# EAGLE design esp8266-dev-ftdi (EAGLE 7.1.0)
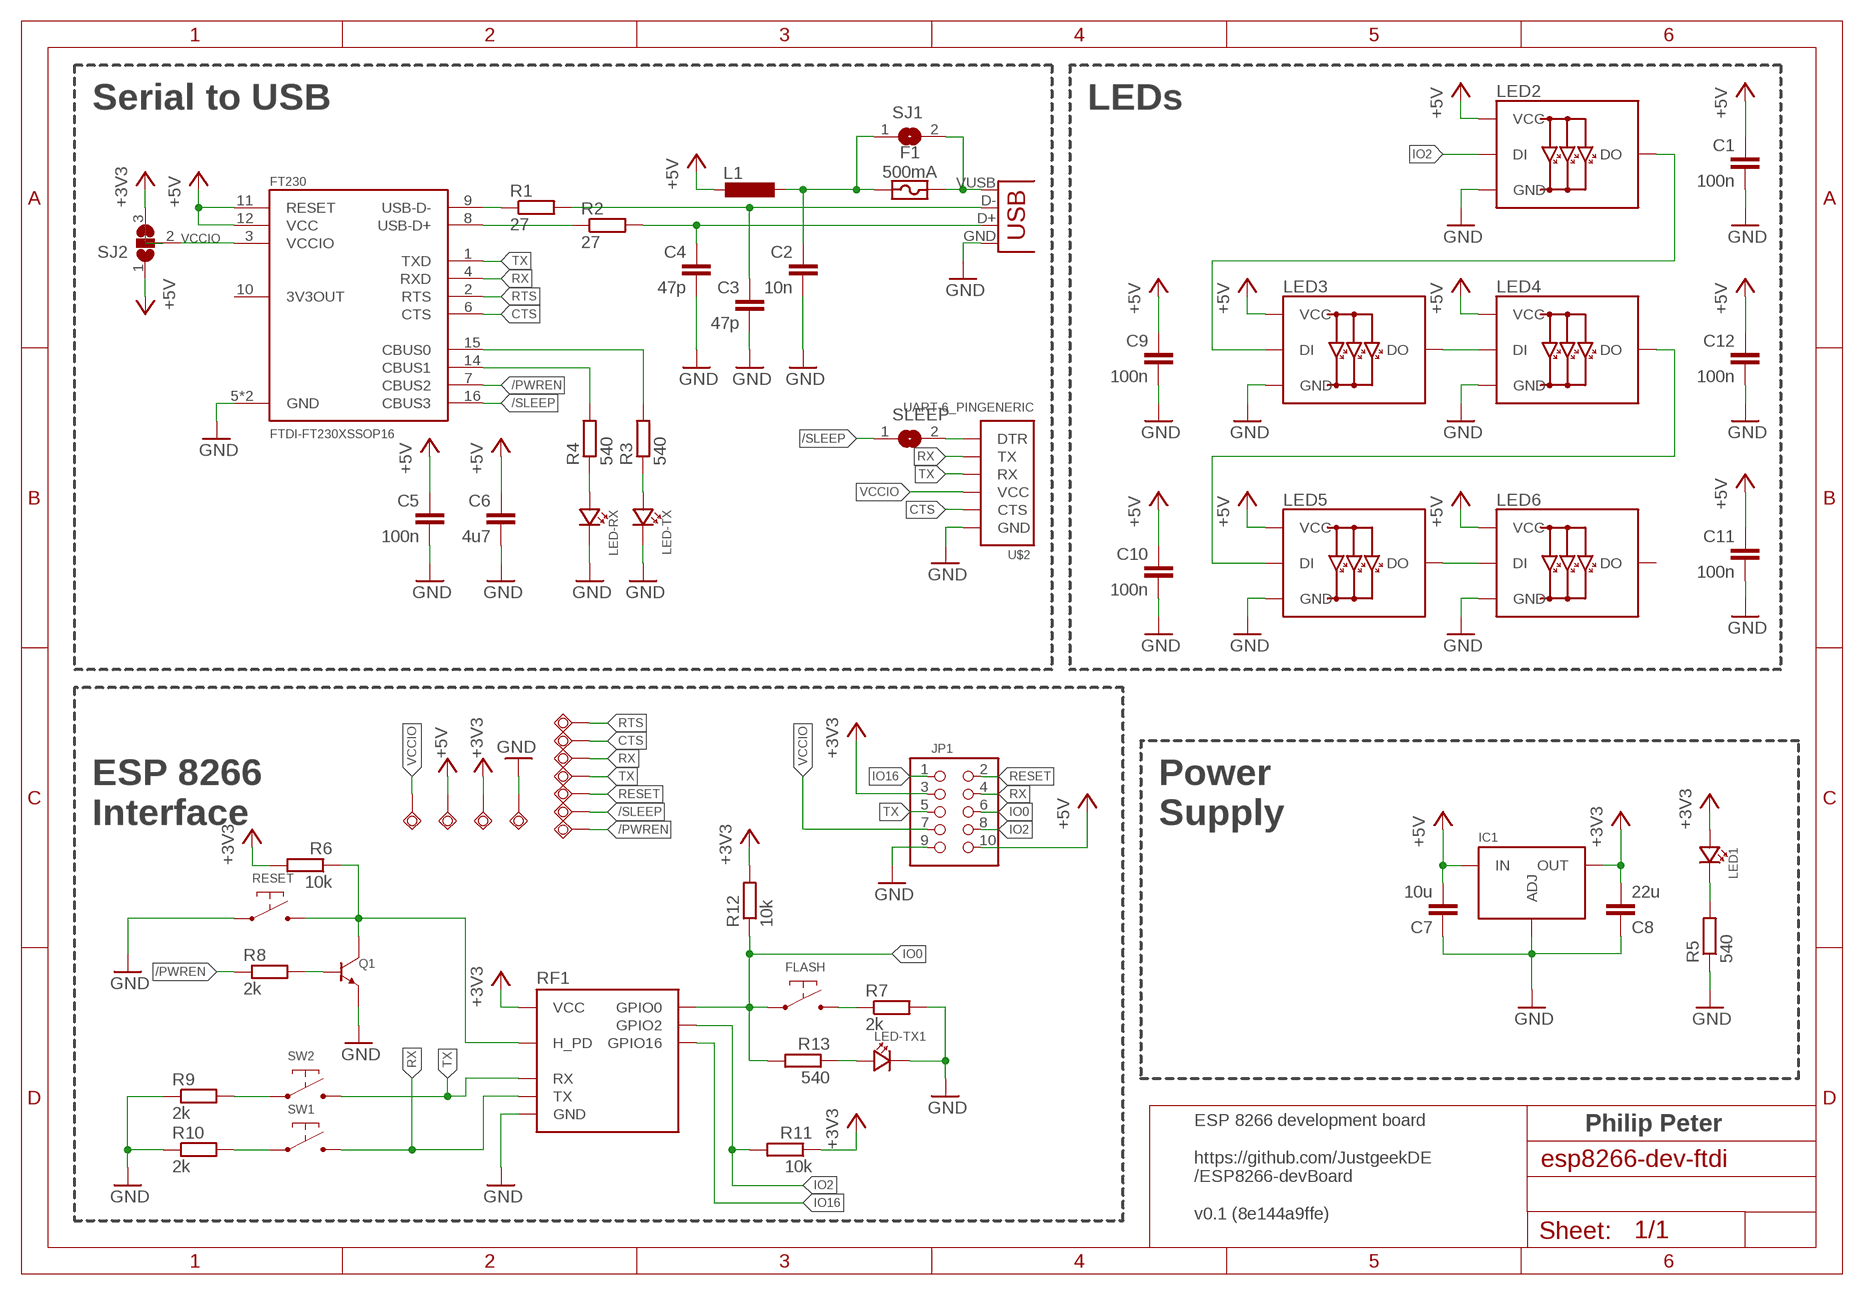
[diagram p0: schematic, sheet 1]

## Parts
3V3  TPSQTP15R  [TP15R]
5V  TPSQTP15R  [TP15R]
C1  100n  C-EUC0805  [C0805]
C2  10n  C-EUC0805  [C0805]
C3  47p  C-EUC0805  [C0805]
C4  47p  C-EUC0805  [C0805]
C5  100n  C-EUC0805  [C0805]
C6  4u7  C-EUC0805  [C0805]
C7  10u  C-EUC0805  [C0805]
C8  22u  C-EUC0805  [C0805]
C9  100n  C-EUC0805  [C0805]
C10  100n  C-EUC0805  [C0805]
C11  100n  C-EUC0805  [C0805]
C12  100n  C-EUC0805  [C0805]
CON1  USBMICRO-NO_CENTER-LONG_PADS  [USB-MICRO-SMD-NO_CENTER-LONG_PADS]
CTS  TPSQTP15R  [TP15R]
F1  500mA  FUSE0805  [SMD-FUSE-0805]
FLASH  SWITCH-DEFAULT_OFF-DEFAULT  [SWITCH-GENERIC-4_PIN]
FT230  FTDI-FT230XSSOP16  [SSOP-16-FTDI]
GND  TPSQTP15R  [TP15R]
IC1  REGULATOR-LM317-SOT223  [SOT223]
JP1  GENERIC-2X5  [PINHEADER-100MIL-2X5-NOSILK]
L1  875-MI0805K601R-10  INDUCTOR0805  [R0805]
LED1  LED0805  [CHIPLED_0805]
LED2  WS2812B  [CHIP-5050-4_PIN]
LED3  WS2812B  [CHIP-5050-4_PIN]
LED4  WS2812B  [CHIP-5050-4_PIN]
LED5  WS2812B  [CHIP-5050-4_PIN]
LED6  WS2812B  [CHIP-5050-4_PIN]
LED-RX  LED0805  [CHIPLED_0805]
LED-TX  LED0805  [CHIPLED_0805]
LED-TX1  LED0805  [CHIPLED_0805]
PEN  TPSQTP15R  [TP15R]
Q1  TRANSISTOR-NPN-GENERIC-SOT23-BEC  [SOT23]
R1  27  R-EU_R0805  [R0805]
R2  27  R-EU_R0805  [R0805]
R3  540  R-EU_R0805  [R0805]
R4  540  R-EU_R0805  [R0805]
R5  540  R-EU_R0805  [R0805]
R6  10k  R-EU_R0805  [R0805]
R7  2k  R-EU_R0805  [R0805]
R8  2k  R-EU_R0805  [R0805]
R9  2k  R-EU_R0805  [R0805]
R10  2k  R-EU_R0805  [R0805]
R11  10k  R-EU_R0805  [R0805]
R12  10k  R-EU_R0805  [R0805]
R13  540  R-EU_R0805  [R0805]
RES  TPSQTP15R  [TP15R]
RESET  SWITCH-DEFAULT_OFF-2PIN  [SWITCH-GENERIC-2_PIN]
RF1  ESP2866-ESP-01THT  [ESP8266-ESP-01]
RTS  TPSQTP15R  [TP15R]
RX  TPSQTP15R  [TP15R]
SJ1  SJ  [SJ]
SJ2  SJ2W  [SJ_2]
SLE  TPSQTP15R  [TP15R]
SLEEP  SJ  [SJ]
SW1  SWITCH-DEFAULT_OFF-2PIN  [SWITCH-GENERIC-2_PIN]
SW2  SWITCH-DEFAULT_OFF-2PIN  [SWITCH-GENERIC-2_PIN]
TX  TPSQTP15R  [TP15R]
U$2  UART-6_PINGENERIC  [PINHEADER-100MIL-1X6]
VCC  TPSQTP15R  [TP15R]

## Nets
+3V3: 3V3.TP C8.2 IC1.2(OUT) IC1.4(OUT) JP1.3 LED1.A R6.2 R11.1 R12.2 RF1.VCC SJ2.3
+5V: 5V.TP C1.1 C5.1 C6.1 C7.2 C9.1 C10.1 C11.1 C12.1 FT230.11(RESET) FT230.12(VCC) IC1.3(IN) JP1.10 L1.2 LED2.P$1(VCC) LED3.P$1(VCC) LED4.P$1(VCC) LED5.P$1(VCC) LED6.P$1(VCC) SJ2.1
/PWREN: FT230.7(CBUS2) PEN.TP R8.1
/SLEEP: FT230.16(CBUS3) SLE.TP SLEEP.1
CTS: CTS.TP FT230.6(CTS) U$2.2(CTS)
GND: C1.2 C2.2 C3.2 C4.2 C5.2 C6.2 C7.1 C8.1 C9.2 C10.2 C11.2 C12.2 CON1.GND FT230.5(GND) FT230.13(GND) GND.TP IC1.1(ADJ) JP1.9 LED2.P$3(GND) LED3.P$3(GND) LED4.P$3(GND) LED5.P$3(GND) LED6.P$3(GND) LED-RX.C LED-TX1.C LED-TX.C Q1.P$2(EMITTER) R5.1 R7.2 R9.1 R10.1 RESET.P$1 RF1.GND U$2.1(GND)
IO0: FLASH.P$1 FLASH.P$2 JP1.6 R12.1 R13.2 RF1.GPIO0
IO2: JP1.8 LED2.P$4(DI) R11.2 RF1.GPIO2
IO16: JP1.1 RF1.GPIO16
N$1: Q1.P$1(BASE) R8.2
N$2: C2.1 F1.1 L1.1 SJ1.1
N$3: LED-TX.A R3.1
N$4: C3.1 CON1.D- R1.2
N$5: FT230.9(USB-D-) R1.1
N$6: FT230.8(USB-D+) R2.1
N$7: C4.1 CON1.D+ R2.2
N$8: LED-RX.A R4.1
N$9: LED1.C R5.2
N$10: SLEEP.2 U$2.6(DTR)
N$11: FLASH.P$3 FLASH.P$4 R7.1
N$12: LED2.P$2(DO) LED3.P$4(DI)
N$13: FT230.15(CBUS0) R3.2
N$14: FT230.14(CBUS1) R4.2
N$15: LED3.P$2(DO) LED4.P$4(DI)
N$16: LED4.P$2(DO) LED5.P$4(DI)
N$17: LED5.P$2(DO) LED6.P$4(DI)
N$18: CON1.VUSB(VBUS) F1.2 SJ1.2
N$20: R9.2 SW2.P$1
N$21: R10.2 SW1.P$1
N$22: LED-TX1.A R13.1
RESET: JP1.2 Q1.P$3(COLLECTOR) R6.1 RES.TP RESET.P$2 RF1.H_PD
RTS: FT230.2(RTS) RTS.TP
RX: FT230.4(RXD) JP1.4 RF1.TX RX.TP SW1.P$2 U$2.5(TX)
TX: FT230.1(TXD) JP1.5 RF1.RX SW2.P$2 TX.TP U$2.4(RX)
VCCIO: FT230.3(VCCIO) JP1.7 SJ2.2 U$2.3(VCC) VCC.TP
Unconnected: FT230.10(3V3OUT) LED6.P$2(DO)

## Notes on the sheet
- Serial to USB | LEDs
- ESP 8266
  Interface
- Power
  Supply
- ESP 8266 development board
  
  https://github.com/JustgeekDE
  /ESP8266-devBoard
  
  v0.1 (8e144a9ffe)
- Philip Peter

## Library data of the parts
3V3 5V CTS GND PEN RES RTS RX SLE TX VCC = testpad:TPSQ: Test pad
C1-C12 = p.peter-rcl:C-EU: CAPACITOR, European symbol
CON1 = p.peter-connectors:USB
F1 = p.peter-regulators:FUSE
FLASH RESET SW1 SW2 = p.peter-passives:SWITCH-DEFAULT_OFF
FT230 = p.peter-ics:FTDI-FT230X
IC1 = p.peter-regulators:REGULATOR-LM317
JP1 = p.peter-connectors:GENERIC-2X5
L1 = p.peter-passives:INDUCTOR
LED1 LED-RX LED-TX LED-TX1 = p.peter-leds:LED
LED2-LED6 = p.peter-leds:WS2812B
Q1 = p.peter-ics:TRANSISTOR-NPN-GENERIC
R1-R13 = p.peter-rcl:R-EU_: RESISTOR, European symbol
RF1 = p.peter-periphery:ESP2866-ESP-01
SJ1 SLEEP = jumper:SJ: SMD solder JUMPER
SJ2 = jumper:SJ2W: SMD solder JUMPER
U$2 = p.peter-connectors:UART-6_PIN: RX and TX direction as seen from outside. I.e. connect RX from connector to RX from Atmega

## Board
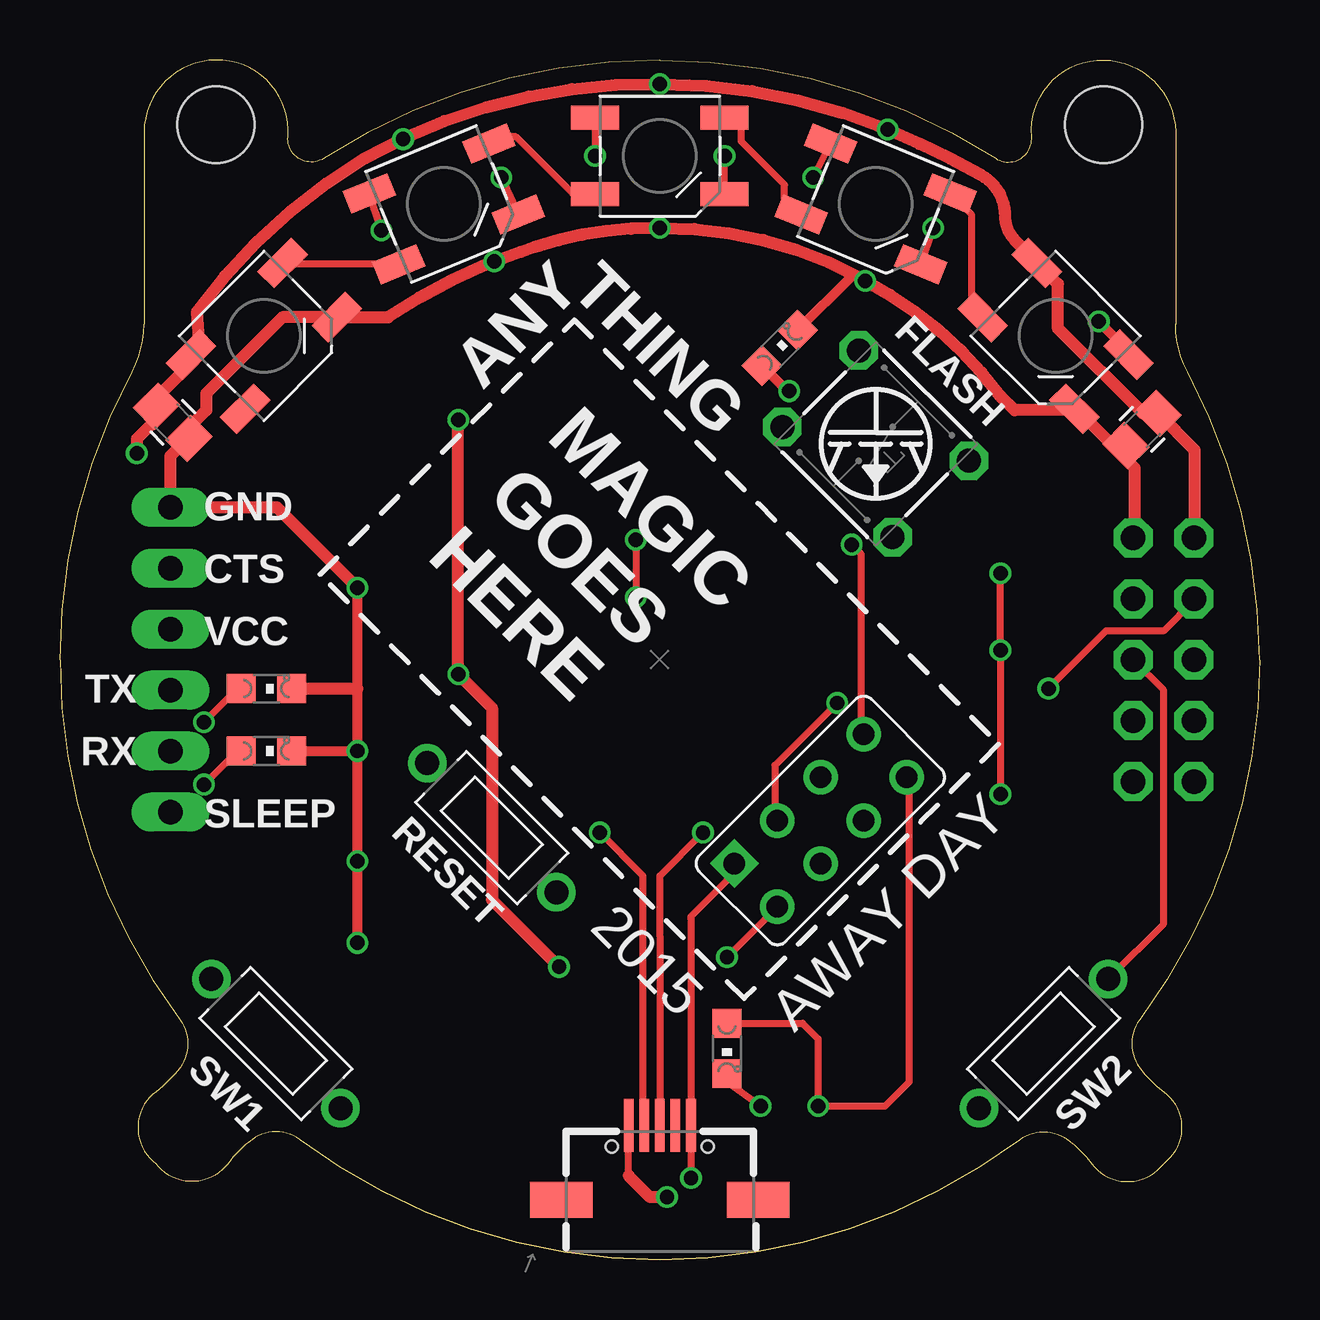
[diagram p1: board, top side]
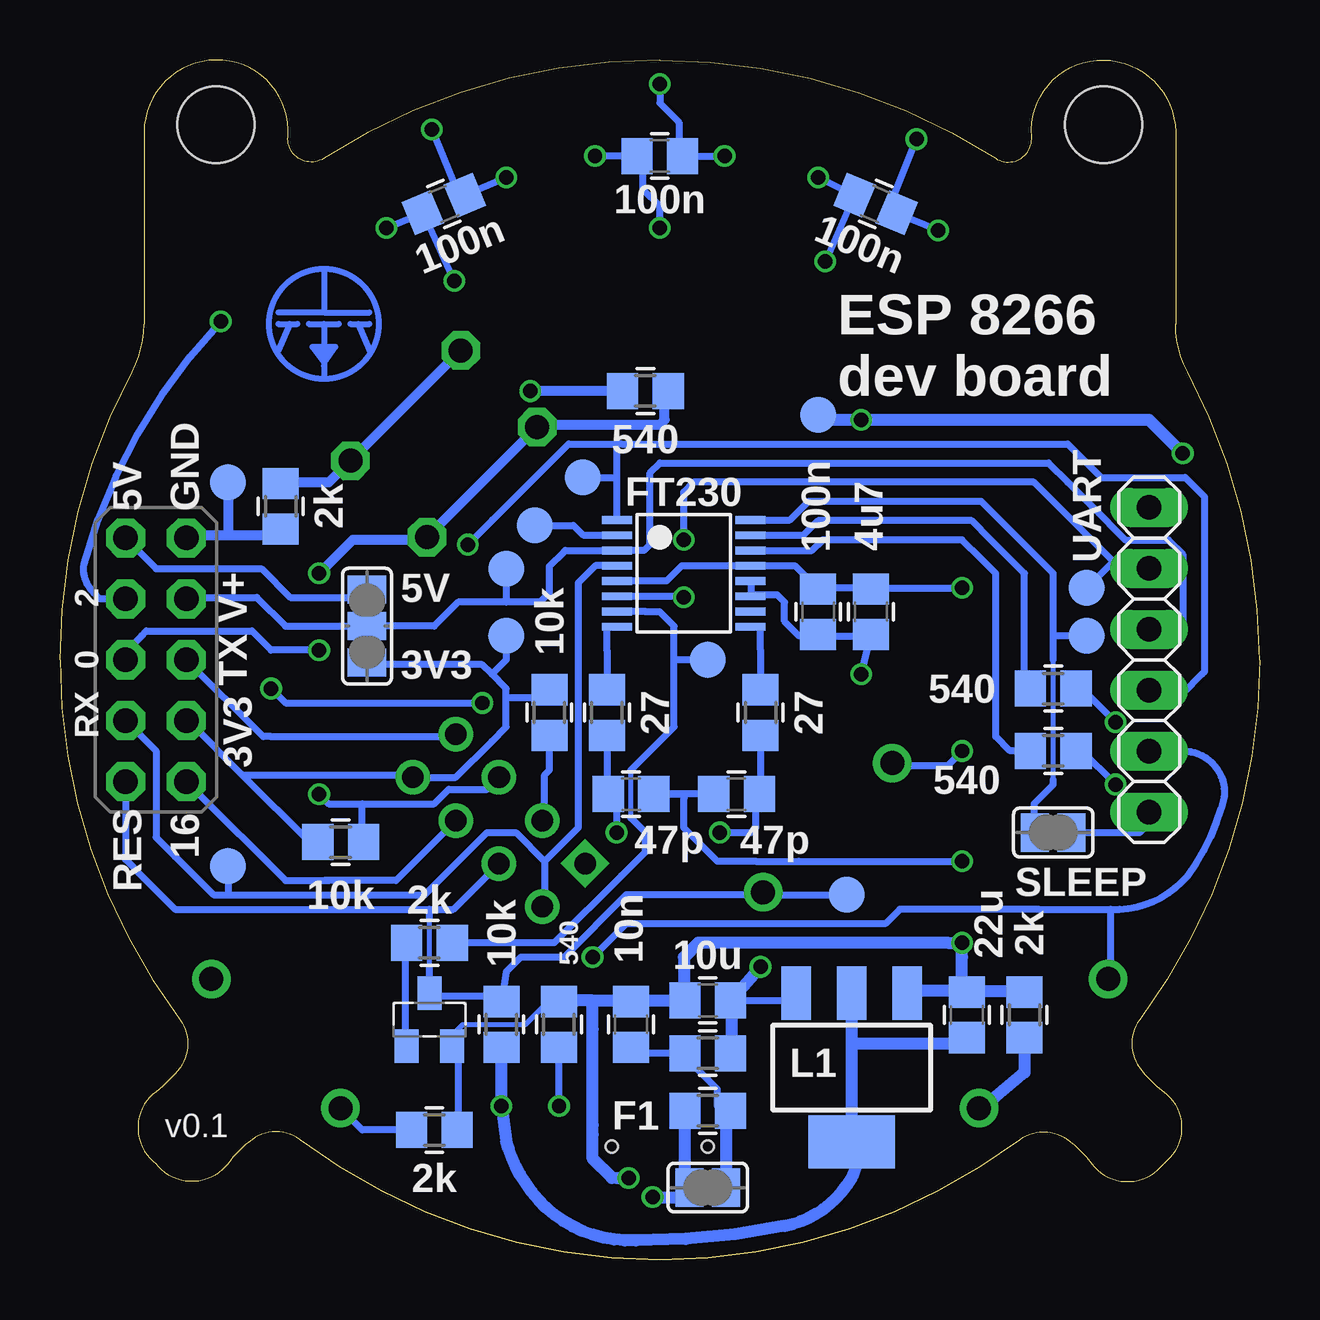
[diagram p2: board, bottom side, seen from below]

Size 50 x 50 mm. Coordinates in mm from the lower left corner, seen from the top.
Outline: 3.5,41 3.5,39.5
Outline: 3.5,39.5 3.5,39 arc-28 3,37 arc28 0,25 arc37 5,10
Outline: 3.5,39.5 3.5,47 arc-88 6.5,50 arc-95 9.5,46.8 arc127 11,45.9 arc-33 25,50 arc-33 39,45.9 arc127 40.5,46.8 arc-95 43.5,50 arc-88 46.5,47 46.5,39.5 46.5,39 arc28 47,37 arc-28 50,25 arc-37 45,10
Outline: 10,5 arc37 25,0
Outline: 25,0 arc-37 10,5
Outline: 5,10 arc-74 5,8
Outline: 5,8 arc-16 4,7 arc106 4,4 arc106 7,4 arc-16 8,5
Outline: 5,10 arc-74 5,8
Outline: 10,5 arc74 8,5
Outline: 10,5 arc74 8,5
Outline: 40,5 arc-37 25,0
Outline: 25,0 arc37 40,5
Outline: 45,10 arc74 45,8
Outline: 45,8 arc16 46,7 arc-106 46,4 arc-106 43,4 arc16 42,5
Outline: 45,10 arc74 45,8
Outline: 40,5 arc-74 42,5
Outline: 40,5 arc-74 42,5
Copper layers (1*16): Top 0.035mm / dielectric 1.5mm / Bottom 0.035mm
Design rules "dirt_cheap_dirty_boards.v1 *": minimum track width 5mil, minimum drill 12mil, track to track 5mil, track to pad 5mil, pad to pad 5mil, via to via 5mil, smd to smd 0mil, copper to edge 10mil, drill to drill 10mil, minimum pad ring 10mil, minimum via ring 6mil, stop-mask expansion 2mil, vias tented up to drill 25mil, thermal gap 10mil
Holes 3.2 mm at 6.5,47.3 43.5,47.3

### Footprints (pad centres in the part's own frame; a part is rotated, then mirrored left to right if it is on the bottom)
TP15R = smd 1.5 x 1.5: TP 0,0
C0805 = smd 1.3 x 1.5: 1 -0.95,0; 2 0.95,0
USB-MICRO-SMD-NO_CENTER-LONG_PADS = smd 2.2 x 0.4: D+ 3.1,0; D- 3.1,0.65; GND 3.1,-1.3; ID 3.1,-0.65; VUSB 3.1,1.3 | smd 1.5 x 2.6: P$1 0,4.1; P$2 0,-4.1 | hole 0.5: 2.2,2; 2.2,-2
SMD-FUSE-0805 = smd 1.3 x 1.5: 1 -0.95,0; 2 0.95,0
SWITCH-GENERIC-4_PIN = drill 1 octagon: P$1 2.25,3.25; P$2 2.25,-3.25; P$3 -2.25,3.25; P$4 -2.25,-3.25
SSOP-16-FTDI = smd 0.32 x 1.26: 1 -2.223,-2.779; 2 -1.588,-2.779; 3 -0.953,-2.779; 4 -0.318,-2.779; 5 0.317,-2.779; 6 0.952,-2.779; 7 1.587,-2.779; 8 2.222,-2.779; 9 2.222,2.779; 10 1.587,2.779; 11 0.952,2.779; 12 0.317,2.779; 13 -0.318,2.779; 14 -0.953,2.779; 15 -1.588,2.779; 16 -2.223,2.779
SOT223 = smd 1.219 x 2.235: 1 -2.311,-3.099; 2 0,-3.099; 3 2.311,-3.099 | smd 3.6 x 2.2: 4 0,3.099
PINHEADER-100MIL-2X5-NOSILK = drill 1.016 octagon: 1 -5.08,-1.27; 2 -5.08,1.27; 3 -2.54,-1.27; 4 -2.54,1.27; 5 0,-1.27; 6 0,1.27; 7 2.54,-1.27; 8 2.54,1.27; 9 5.08,-1.27; 10 5.08,1.27
R0805 = smd 1.3 x 1.5: 1 -0.95,0; 2 0.95,0
CHIPLED_0805 = smd 1.2 x 1.2: A 0,-1.05; C 0,1.05
CHIP-5050-4_PIN = smd 2 x 1: P$1 -2.7,1.6; P$2 -2.7,-1.6; P$3 2.7,-1.6; P$4 2.7,1.6
SOT23 = smd 1 x 1.4: P$1 -0.95,-1.1; P$2 0.95,-1.1; P$3 0,1.1
SWITCH-GENERIC-2_PIN = drill 1: P$1 -3.81,0; P$2 3.81,0
ESP8266-ESP-01 = drill 0.9 square: GND 1.27,3.81 | drill 0.9: GPIO0 1.27,-1.27; GPIO2 1.27,1.27; GPIO16 -1.27,-1.27; H_PD -1.27,1.27; RX 1.27,-3.81; TX -1.27,3.81; VCC -1.27,-3.81
SJ = smd 1.168 x 1.6: 1 -0.762,0; 2 0.762,0
SJ_2 = smd 1.168 x 1.6: 1 -1.524,0; 2 0,0; 3 1.524,0
PINHEADER-100MIL-1X6 = drill 1.016 long: 1 -6.35,0; 2 -3.81,0; 3 -1.27,0; 4 1.27,0; 5 3.81,0; 6 6.35,0

### Placement (x,y rotation side)
3V3  31.4,26 0 bottom
5V  18.4,35.2 0 bottom
C1  45.1,34.6 225 top
C2  26.2,9.8 90 bottom
C3  21.8,19.4 180 bottom
C4  26.2,19.4 0 bottom
C5  18.4,27 90 bottom
C6  16.2,27 90 bottom
C7  23,10.8 0 bottom
C8  12.2,10.2 270 bottom
C9  25,46 180 bottom
C10  16,44 157.5 bottom
C11  34,44 202.5 bottom
C12  4.7,34.9 315 top
CON1  25,2.5 90 top
CTS  7.2,28 0 bottom
F1  23,6.2 180 bottom
FLASH  34,34 225 top
FT230  24,28.6 270 bottom
GND  43,32.4 0 bottom
IC1  17,8 180 bottom
JP1  46,25 90 bottom
L1  23,8.6 0 bottom
LED1  27.8,8.8 180 top
LED2  41.5,38.5 315 top
LED3  34,44 337.5 top
LED4  25,46 0 top
LED5  16,44 22.5 top
LED6  8.5,38.5 45 top
LED-RX  8.6,21.2 270 top
LED-TX  8.6,23.8 270 top
LED-TX1  30,38 315 top
PEN  23,25 0 bottom
Q1  34.6,10 0 bottom
R1  20.8,22.8 270 bottom
R2  27.2,22.8 270 bottom
R3  8.6,23.8 180 bottom
R4  8.6,21.2 180 bottom
R5  29.2,9.8 270 bottom
R6  31.6,9.8 270 bottom
R7  40.8,31.4 270 bottom
R8  34.6,13.2 180 bottom
R9  34.4,5.4 180 bottom
R10  9.8,10.2 270 bottom
R11  29.6,22.8 270 bottom
R12  38.3,17.4 180 bottom
R13  25.6,36.2 0 bottom
RES  17.2,15.2 0 bottom
RESET  18,18 315 top
RF1  31.7,18.3 135 top
RTS  30.2,30.6 0 bottom
RX  43,16.4 0 bottom
SJ1  23,3 180 bottom
SJ2  37.2,26.4 270 bottom
SLE  7.2,26 0 bottom
SLEEP  8.6,17.8 0 bottom
SW1  9,9 135 top
SW2  41,9 45 top
TX  28.2,32.6 0 bottom
U$1  [LOGO-JUSTGEEK-XS-PAD]  39,39 0 bottom
U$2  4.6,25 270 bottom
U$3  [LOGO-JUSTGEEK-XS]  34,34 0 top
VCC  31.4,28.8 0 bottom

### Tracks (layer width: path | path; a pad name or v marks a point on that pad's centre or on a via)
+3V3  (via drill 0.6)
  Top 0.3: RF1.VCC 35.4,19.99 35.4,19.4 35.4,7.4 34.4,6.4 v31.6,6.4 31.6,9.2 30.95,9.85 LED1.A
  Bottom 0.3: C8.2 12.4,9 | RF1.VCC 35.3,20.1 35.4,20 | RF1.VCC 33.5,20.1 32,21.6 31.4,22.2 31.4,23.4 | R11.1 29.55,23.4 29.4,23.4 31.4,23.4 | 42.4,20.2 35.4,20.2 RF1.VCC | JP1.3 44.66,22.46 44.6,22.4 42.4,20.2 | 31.4,23.4 31.4,23.8 32,24.4 | 32,24.4 32.4,24.8 37.12,24.8 | 37.12,24.8 SJ2.3 | 3V3.TP 31.4,25 32,24.4 | 42.4,20.2 39.6,17.4 R12.2 | 37.12,24.8 37.2,24.9 37.2,26.1
  Bottom 0.5: 17,9 17,8.2 IC1.4 arc61 17,3.4 arc48 19.8,1.4 arc12 26,0.8 arc60 30.6,3.2 arc22 31.4,5 v31.6,6.4 R6.2 | 17,9 IC1.2 | 12.4,9 17,9
+5V  (via drill 0.6)
  Top 0.3: LED2.P$1 40.94,41.54 | 32.2,46.6 LED3.P$1 v31.4,45.1 | 22.4,47.6 LED4.P$1 23,47.8 22.6,47.8 22.3,47.5 v22.3,46 | 13.04,44.45 LED5.P$1 v13.4,42.9 | 5.8,38.06 LED6.P$1 | 5.4,37.6 5.46,37.66 | 12.7,45.9 v14.3,46.7
  Top 0.5: v16.6,35 v16.6,24.4 18,23 18,15 v20.8,12.2 | 5.46,37.66 LED6.P$1 | JP1.10 47.3,30.08 47.3,30.1 47.3,33.74 C1.1 45.13,35.27 41.6,38.8 41.6,40.66 LED2.P$1 39.8,42.5 arc-44 39.4,43.5 arc61 38.4,45.2 arc6 v34.5,47.1 32.6,47.8 arc18 v25,49 arc30 12.7,45.9 arc23 5.7,39.5 5.8,38.06 | 5.4,37.6 5.4,37.5 5.2,37.14 5.2,37.1 4.9,36.8 4.03,35.93 C12.1 4.1,35.5 4.1,35.1 3.2,34.2 v3.2,33.6
  Bottom 0.3: IC1.3 19.61,10.8 21.8,10.8 C7.2 | L1.2 22,8.6 | 22,10.75 C7.2 | 21.8,11.05 C7.2 | C6.1 16.65,26 18.8,26 C5.1 18.85,26 19.2,26 19.8,26.6 19.8,27.4 20,27.6 20.1,27.7 21.17,27.7 | C6.1 16.6,26 | JP1.10 47,29.8 46,28.8 41.6,28.8 40.4,27.6 37.12,27.6 SJ2.1 | v16.6,24.4 C6.1 | 21.17,27.7 FT230.11 | 21.17,27.7 21.17,28.23 FT230.12 | C10.1 15.12,43.62 15.5,43.8 | v13.4,42.9 15.1,43.6 C10.1 | v14.3,46.7 15.3,44.2 C10.1 | v22.3,46 C9.1 24.2,46.15 24.2,47.4 25,48.2 v25,49 | v34.5,47.1 33.3,44.2 C11.1 v31.4,45.1
  Bottom 0.5: 22,8.6 22,10.75 | v20.8,12.2 21.8,11.05 | v3.2,33.6 4.6,35 14.3,35 v16.6,35 18.2,35 5V.TP
/PWREN
  Bottom 0.2: 26.2,18.4 26.2,20.4
  Bottom 0.3: R8.1 29.4,13.2 26.6,16 25.6,17 25.6,17.8 26.2,18.4 | 26.2,20.4 25.4,21.2 24.4,22.2 24.4,25 | 24.4,25 24.4,26.4 25,27 25.6,27 25.61,27.01 FT230.7 | PEN.TP 24.4,25
/SLEEP
  Bottom 0.2: 8.6,20 8.6,25
  Bottom 0.3: 8.6,20 8.6,19.8 9.4,19 9.4,17.84 SLEEP.1 | 21.2,30.8 FT230.16 19.58,30.82 18.8,31.6 11.6,31.6 10.8,30.8 8.6,28.6 8.6,26 | 8.6,25 8.6,26 | SLE.TP 8.6,26
CTS  (via drill 0.6)
  Top 0.3: v24,30 v24,27.6
  Bottom 0.3: U$2.2 5.8,28.8 6.1,29.1 | 6.1,29.1 7.2,30.2 8.6,31.6 9.4,32.4 23.6,32.4 24,32 v24,30 | FT230.6 24.05,27.65 arc90 v24,27.6 | CTS.TP 6.1,29.1
GND  (via drill 0.6)
  Top 0.3: CON1.GND 26.3,5.2 26.3,5.1 | 26.3,5.1 26.3,3.6 | 26.3,3.6 v26.3,3.4 26.3,3.6 | RF1.GND 28.11,16.11 26.8,14.8 26.3,14.3 | 26.3,14.3 26.3,14.2 | 26.3,14.2 26.3,14.3 | 26.3,14.3 26.3,14.2 | 26.3,14.2 26.3,5.1 | 19.2,43.6 19.15,43.6 LED5.P$3 v18.4,45.1 | 27.6,44.4 LED4.P$3 v27.7,46 | 42.2,35.4 42.26,35.46 LED2.P$3 42.34,35.46 | 39.8,35.4 39.2,36 | 44.8,30.15 JP1.9 | 4.6,31.41 U$2.1 | 9.6,21.25 LED-RX.C | v18.1,41.6 19.2,42 | LED3.P$3 v36.4,43 | v33.57,40.79 33.2,41 | 9.6,23.8 LED-TX.C 9.6,23.8
  Top 0.406: v12.4,13.2 v12.4,16.6 12.4,19.6 v12.4,21.2 | v12.4,21.2 12.4,23.8 v12.4,28 | LED-RX.C v12.4,21.2 | LED-TX1.C 33,41 33.2,41 v33.57,40.79 34.6,40.2
  Top 0.5: 42.2,35.4 39.8,35.4 39.2,36 arc22 34.6,40.2 arc33 v25,43 24.8,43 arc18 19.8,42.2 19.2,42 arc16 13.68,39.28 LED6.P$3 9.28,39.28 8.4,38.4 6.1,36.1 6.1,35.4 5.37,34.67 C12.2 5.33,34.23 4.6,33.5 U$2.1 9.05,31.35 v12.4,28 | 42.34,35.46 44,33.8 44.15,33.65 | 44.15,33.65 44.6,33.2 44.8,33 44.8,30.2 44.8,30.15 | 9.6,23.8 9.8,23.8 12.4,23.8 | C1.2 44.15,33.65
  Bottom 0.2: Q1.P$2 33.65,9.35 33.2,9.8 30.6,9.8 29.8,10.6 28.95,10.6 R5.1
  Bottom 0.3: 12.75,11.15 12.8,11.2 | 14.59,11.2 IC1.1 | 24,10.85 C7.1 | 26.8,3.4 27,3.4 | 27,3.4 26.8,3.4 | 26,10.8 26.05,10.75 C2.2 26.25,10.8 | 27.8,10.8 28.4,10.8 R5.1 28.45,10.8 | 26.8,3.4 27,3.4 | 16.6,28 15.8,28 v12.4,28 | 16.6,28 18.8,28 C5.2 19.37,28.92 FT230.13 24.08,28.92 24.6,28.4 24.7,28.3 26.16,28.3 FT230.5 | C6.2 16.6,28 | C3.2 24,19.4 | 24,19.4 C4.2 24,19.4 | Q1.P$2 33.4,8.8 33.4,5.45 R9.1 | 24,19.4 24,19.2 24,18 23.6,17.6 22.6,16.6 21,16.6 19.2,16.6 v12.4,16.6 | v12.4,21.2 13,20.6 15.2,20.6 15.29,20.69 RESET.P$1 | v18.4,45.1 17,44.4 C10.2 v18.1,41.6 | v27.7,46 C9.2 25.7,45.75 25.7,44.6 25,43.9 v25,43 | 34.88,43.62 34.9,43.6 35.2,43.5 v36.4,43 | C11.2 34.88,43.62 | 34.88,43.62 34.8,43.5 v33.57,40.79 | C8.1 12.4,11.2 C8.1
  Bottom 0.406: JP1.9 44.8,30.08 44.8,30.2 43,30.2 | 43,30.2 40.8,30.2 R7.2 | GND.TP 43,30.2
  Bottom 0.5: C8.1 12.75,11.15 | 12.8,11.2 14.59,11.2 | 24,10.85 24,12.6 23.4,13.2 18.6,13.2 13,13.2 v12.4,13.2 12.4,12.6 12.4,11.2 10.25,11.2 R10.1 | 26.8,3.4 v26.3,3.4 | 26,10.8 C7.1 | 27.8,10.8 26.25,10.8 | 27,3.4 27.8,4.2 27.8,5.2 27.8,5.6 27.8,9.6 27.8,10.8 | 27.8,10.8 28.45,10.8
IO0  (via drill 0.6)
  Top 0.3: v39.2,19.4 v39.2,25.4 v39.2,28.6
  Bottom 0.3: JP1.6 47.27,25.33 46.6,26 46.4,26.2 42,26.2 41.5,25.7 | 41.5,25.7 41.2,25.4 | v39.2,19.4 38.8,19 37.4,19 | 37.4,19 34.4,19 33.8,19.6 32.2,19.6 RF1.GPIO0 | v39.2,25.4 41.2,25.4 | 41.2,25.4 41.5,25.7 | R12.1 37.4,17.45 37.4,19
  Bottom 0.406: v39.2,28.6 37.8,30 34.8,30 34.71,30.09 FLASH.P$1 FLASH.P$2 30.09,34.71 30,34.8 25,34.8 24.8,35 24.8,35.75 R13.2
IO2  (via drill 0.6)
  Top 0.3: JP1.8 47.27,27.47 46,26.2 43.6,26.2 v41.2,23.8 | v32.4,23.2 29.8,20.6 29.8,18.4 RF1.GPIO2
  Top 0.406: LED2.P$4 44.68,37.72 v43.3,39.1
  Bottom 0.3: RF1.GPIO2 29.8,18.4 29.8,20.2 29.6,20.4 R11.2 | JP1.8 48.34,27.54 48.6,27.8 arc53 49,29 arc28 v43.3,39.1 | v41.2,23.8 40.6,23.2 v32.4,23.2
IO16
  Bottom 0.3: RF1.GPIO16 33.8,18 36,15.8 38.8,15.8 | 44.65,20 JP1.1 44.61,19.8 44.6,19.8 44.4,19.6 40.6,15.8 38.8,15.8 | 38.8,15.8 39,15.8
N$1
  Bottom 0.3: Q1.P$1 35.35,8.85 35.6,8.8 35.6,13.15 R8.2
N$2
  Bottom 0.3: 22.24,6.4 22.2,6.4 F1.1 22.6,6.4 22.6,7 22.6,7.1 23.5,8 23.5,8.15 L1.1 24.4,8.6 25.2,8.6 25.4,8.6 25.95,8.6 C2.1
  Bottom 0.5: 22.24,6.4 SJ1.1
N$3  (via drill 0.6)
  Top 0.3: LED-TX.A 7.4,23.8 v6,22.4
  Bottom 0.3: v6,22.4 6.6,23 7.4,23.8 R3.1
N$4  (via drill 0.6)
  Top 0.3: CON1.D- 24.35,5.75 24.4,5.8 24.4,6.4 24.3,6.5 24.3,13.5 24.3,16 v22.5,17.8
  Bottom 0.3: R1.2 20.8,19.45 C3.1 | 20.8,19.35 C3.1 | v22.5,17.8 21.2,17.8 21,18 21,19.25 C3.1
N$5
  Bottom 0.3: R1.1 20.8,25.4 20.8,26.38 FT230.9
N$6
  Bottom 0.3: R2.1 27.2,25.4 27.2,26.38 FT230.8
N$7  (via drill 0.6)
  Top 0.3: 25,5.7 CON1.D+ 25,13.5 25,16 v26.8,17.8
  Bottom 0.3: R2.2 27.2,19.45 C4.1 26.8,19.05 v26.8,17.8
N$8  (via drill 0.6)
  Top 0.3: LED-RX.A 7.4,21.2 v6,19.8
  Bottom 0.3: v6,19.8 7.4,21.2 R4.1
N$9  (via drill 0.6)
  Top 0.3: LED1.C 27.8,7.4 v29.2,6.4
  Bottom 0.3: v29.2,6.4 29.2,8.65 R5.2
N$10
  Bottom 0.3: SLEEP.2 5,17.8 4.6,18.2 4.6,18.59 U$2.6
N$11
  Bottom 0.406: R7.1 40.6,32.4 38.78,32.4 FLASH.P$3 FLASH.P$4
N$12
  Top 0.3: LED2.P$2 38.46,39.54 38,40 38,43.55 LED3.P$4
N$13
  Bottom 0.3: R3.2 9.55,24.15 9.8,24.2 9.8,28.6 11.2,30 12,30.8 18.4,30.8 19.01,30.19 FT230.15
N$14
  Bottom 0.3: R4.2 10.4,21.2 11,21.8 11,28.6 11.6,29.2 12.4,30 18.2,30 18.65,29.55 FT230.14
N$15
  Top 0.3: LED3.P$2 30.84,43.55 30.2,44.2 30.2,44.8 28.4,46.6 28.4,47.4 27.9,47.4 LED4.P$4
N$16
  Top 0.3: LED4.P$2 21.4,44.4 19,46.8 18.17,46.8 LED5.P$4
N$17
  Top 0.3: LED5.P$2 9.33,41.49 LED6.P$4
N$18  (via drill 0.6)
  Top 0.3: 23.7,3.5 CON1.VUSB
  Top 0.5: v25.3,2.6 24.6,2.6 23.7,3.5
  Bottom 0.3: 23.8,3 23.95,3
  Bottom 0.5: 23.95,3 F1.2 | 23.8,3 SJ1.2 23.76,2.6 v25.3,2.6
N$20
  Bottom 0.3: R9.2 37.4,5.4 38,6 SW2.P$1
N$21
  Bottom 0.5: R10.2 9.8,7.8 11,6.8 11.49,6.31 SW1.P$1
N$22  (via drill 0.6)
  Top 0.406: v30.4,36.2 30.32,36.2 LED-TX1.A
  Bottom 0.406: R13.1 29.8,36.2 v30.4,36.2
RESET
  Bottom 0.2: 34.6,12.2 34.6,14.2
  Bottom 0.3: Q1.P$3 34.4,11 | 31.45,11 R6.1 31.4,12 30.8,12.6 29,12.6 26.4,15.2 20.8,15.2 RESET.P$2 | 31.6,16.4 RF1.H_PD 31.8,16.4 32.2,16 33.6,14.6 34.6,14.6 | RESET.P$2 | JP1.2 47.27,16.67 46.6,16 45.2,14.6 34.6,14.6 | 34.4,11 34.6,11 34.6,12.2 | 34.6,14.2 34.6,14.6 | 34.4,11 31.45,11 | 31.45,11 31.05,11 | RESET.P$2 20.69,15.29 20.6,15.2 RES.TP
RTS
  Bottom 0.3: RTS.TP 28.6,30.6 28.2,30.2 26.79,30.2 FT230.2
RX  (via drill 0.6)
  Top 0.3: 27.6,12.8 v27.8,12.6 28,12.8 29.8,14.6 RF1.TX
  Bottom 0.3: U$2.5 arc90 4.53,21.2 3.2,21.2 arc113 1.6,18.8 arc21 3,16 arc53 6.2,14.6 | FT230.4 27.68,28.92 28.4,28.2 28.4,18 29.8,16.6 | v27.8,12.6 26.4,14 15.6,14 15,14.6 9.2,14.6 6.2,14.6 | JP1.4 46,21.2 46,17.6 45.2,16.8 43.6,15.2 43,15.2 | 43,15.2 34.8,15.2 33.2,16.8 32.2,17.8 31,17.8 29.8,16.6 | 29.8,16.6 29.8,14.81 RF1.TX | SW1.P$2 6.2,11.8 6.2,14.6 | RX.TP 43,15.2
TX  (via drill 0.6)
  Top 0.3: RF1.RX 33.4,22 33.4,29.2 33.4,29.4 v33,29.8 | SW2.P$2 43.8,11.69 43.8,11.8 46,14 46,18.2 46,23.73 JP1.5
  Bottom 0.3: RF1.RX 33.59,21.8 41.2,21.8 41.53,21.8 JP1.5 | U$2.4 4.41,23.6 3.2,23.6 2.4,24.4 2.3,24.5 2.3,31.8 2.5,32 3.1,32.6 6.6,32.6 8,34 26.6,34 26.8,34 | 26.8,34 26.8,32.6 | 26.8,32.6 26.8,30.84 FT230.1 | v33,29.8 31.98,30.82 28.8,34 26.8,34 | TX.TP 26.8,32.6
VCCIO
  Bottom 0.3: 31.4,27.4 30,27.4 29.6,27.8 29.6,28.9 29,29.5 28.95,29.55 FT230.3 25.65,29.55 25.4,29.8 | 31.4,27.4 33.4,27.4 34.4,26.4 SJ2.2 40.6,26.4 41.8,27.6 44.8,27.6 JP1.7 | 25.4,30 25.4,29.8 | 25.4,29.8 25.4,30 | 25.4,30 25.4,32.8 25,33.2 8.8,33.2 8,32.4 7,31.4 5.6,30 3.8,30 3.2,29.4 3.2,26.6 3.6,26.2 4.47,26.2 U$2.3 | 25.4,30 25.4,29.8 | VCC.TP 31.4,27.4

### Text on the board
tPlace: ANY | THING | MAGIC / GOES / HERE | GND | CTS | VCC | TX | RX | SLEEP | AWAY DAY | 2015
bPlace: ESP 8266 / dev board | UART | GND | 5V | 5V | V+ | 2 | 3V3 | TX | 0 | RX | 3V3 | 16 | RES | v0.1